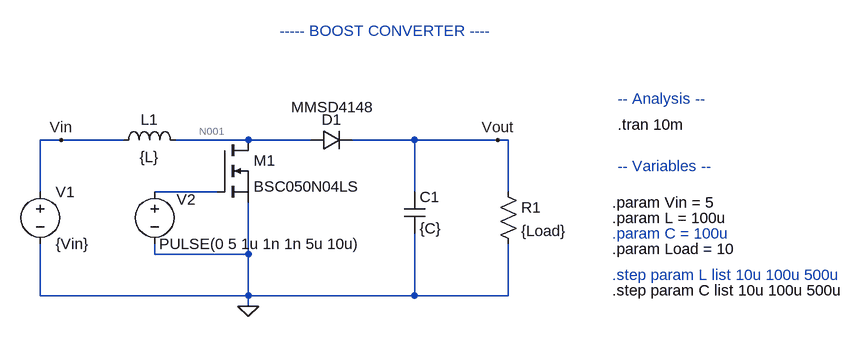
[diagram p0: schematic Boost Converter.asc]
Boost Converter.asc, the LTspice schematic file:
Version 4.1
SHEET 1 1356 680
WIRE 112 64 80 64
WIRE 208 64 112 64
WIRE 400 64 288 64
WIRE 496 64 400 64
WIRE 656 64 560 64
WIRE 784 64 656 64
WIRE 800 64 784 64
WIRE 80 144 80 64
WIRE 352 144 256 144
WIRE 656 144 656 64
WIRE 800 144 800 64
WIRE 256 240 256 224
WIRE 400 240 400 160
WIRE 400 240 256 240
WIRE 80 304 80 224
WIRE 400 304 400 240
WIRE 400 304 80 304
WIRE 656 304 656 208
WIRE 656 304 400 304
WIRE 800 304 800 224
WIRE 800 304 656 304
WIRE 400 320 400 304
FLAG 112 64 Vin
FLAG 784 64 Vout
FLAG 400 320 0
SYMBOL voltage 80 128 R0
WINDOW 123 0 0 Left 0
WINDOW 39 0 0 Left 0
SYMATTR InstName V1
SYMATTR Value {Vin}
SYMBOL res 784 128 R0
SYMATTR InstName R1
SYMATTR Value {Load}
SYMBOL ind 192 80 R270
WINDOW 0 32 56 VTop 2
WINDOW 3 5 56 VBottom 2
SYMATTR InstName L1
SYMATTR Value {L}
SYMATTR SpiceLine Rser=1m
SYMBOL diode 496 80 R270
WINDOW 0 32 32 VTop 2
WINDOW 3 82 34 VBottom 2
SYMATTR InstName D1
SYMATTR Value MMSD4148
SYMBOL cap 640 144 R0
SYMATTR InstName C1
SYMATTR Value {C}
SYMBOL voltage 256 128 R0
WINDOW 0 34 28 Left 2
WINDOW 3 7 96 Left 2
WINDOW 123 0 0 Left 0
WINDOW 39 0 0 Left 0
SYMATTR InstName V2
SYMATTR Value PULSE(0 5 1u 1n 1n 5u 10u)
SYMBOL nmos 352 64 R0
SYMATTR InstName M1
SYMATTR Value BSC050N04LS
TEXT 448 -104 Left 2 ;----- BOOST CONVERTER ----
TEXT 960 160 Left 2 !.param Vin = 5
TEXT 960 184 Left 2 !.param L = 100u
TEXT 960 208 Left 2 ;.param C = 100u
TEXT 960 232 Left 2 !.param Load = 10
TEXT 968 104 Left 2 ;-- Variables --
TEXT 968 0 Left 2 ;-- Analysis --
TEXT 968 40 Left 2 !.tran 10m
TEXT 960 272 Left 2 ;.step param L list 10u 100u 500u
TEXT 960 296 Left 2 !.step param C list 10u 100u 500u

The netlist it stands for:
* Boost Converter.asc
V1 Vin 0 {Vin}
R1 Vout 0 {Load}
L1 Vin N001 {L} Rser=1m
D1 N001 Vout MMSD4148
C1 Vout 0 {C}
V2 N002 0 PULSE(0 5 1u 1n 1n 5u 10u)
M1 N001 N002 0 0 BSC050N04LS
.model D D
.lib standard.dio
.model NMOS NMOS
.model PMOS PMOS
.lib standard.mos
* ----- BOOST CONVERTER ----
.param Vin = 5
.param L = 100u
* .param C = 100u
.param Load = 10
* -- Variables --
* -- Analysis --
.tran 10m
* .step param L list 10u 100u 500u
.step param C list 10u 100u 500u
.backanno
.end

* Results of the author's LTspice run, read from the files saved beside the schematic
* Operating Point (first step), zero values left out:
*   V(n001) = 5 V
*   V(vin) = 5 V
*   V(vout) = 3.922 V
*   I(D1) = 392.2 mA
*   I(L1) = 392.2 mA
*   I(R1) = 392.2 mA
*   I(V1) = -392.2 mA
*   Id(M1) = 25.38 pA
*   Is(M1) = -25.38 pA
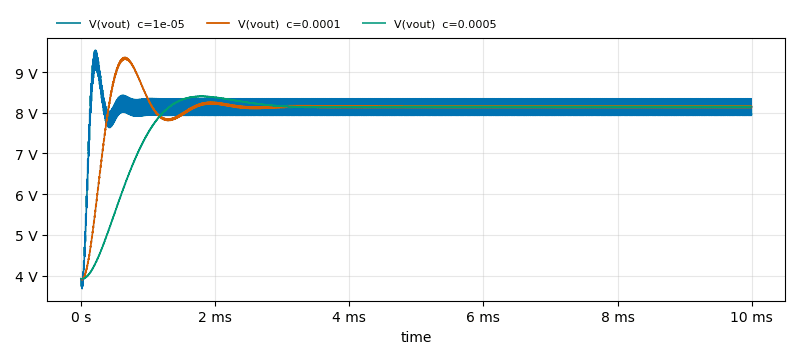
[diagram p1: Transient Analysis of Boost Converter.asc, plotted from the saved traces]
* Transient Analysis, 3 runs:
*   V(vout) [c=1e-05]: min 3.674 V, max 9.535 V, average 8.12 V, rms 8.129 V, last 8.275 V
*   V(vout) [c=0.0001]: min 3.895 V, max 9.362 V, average 8.084 V, rms 8.108 V, last 8.163 V
*   V(vout) [c=0.0005]: min 3.917 V, max 8.407 V, average 7.905 V, rms 7.953 V, last 8.153 V